# Altium schematic sheet Program Counter.SchDoc
size B; Author: E. Sims; Organization: Let's Build Rockets Inc.; SheetNumber: 4; SheetTotal: 11
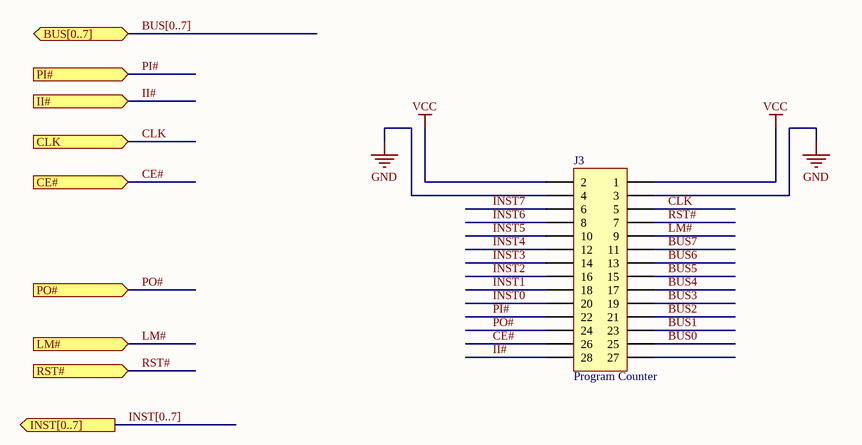
[diagram p0: Program Counter.SchDoc]

## Parts
J3  Program Counter  [HDR2X14]

## Ports
BUS[0..7] (bidir), CE# (in), CLK (in), II# (in), INST[0..7] (out), LM# (in), PI# (in), PO# (in), RST# (in)

## Nets
GND: J3.3 J3.4
VCC: J3.1 J3.2
BUS0: J3.25
BUS1: J3.23
BUS2: J3.21
BUS3: J3.19
BUS4: J3.17
BUS5: J3.15
BUS6: J3.13
BUS7: J3.11
CE#: J3.26 ; port CE#
CLK: J3.5 ; port CLK
II#: J3.28 ; port II#
INST0: J3.20
INST1: J3.18
INST2: J3.16
INST3: J3.14
INST4: J3.12
INST5: J3.10
INST6: J3.8
INST7: J3.6
LM#: J3.9 ; port LM#
PI#: J3.22 ; port PI#
PO#: J3.24 ; port PO#
RST#: J3.7 ; port RST#

Not connected (* = marked no-connect by the designer): J3 27

## Buses and harness runs
bus BUS[0..7] = port BUS[0..7]
bus INST[0..7] = port INST[0..7]

## Notes on the sheet
- Let's Build Rocket's Inc. Modular Paylaod System Based on TMP-010 Rev
  For more information visit https://github.com/LetsBuildRockets/Modular-Payload-System
  This work is licensed under CC BY-NC 4.0. To view a copy of this license, visit https://creativecommons.org/licenses/by-nc/4.0
- Title
- Size:
- Date:
- Assembly Variant:
- B
- Number:
- Time:
- Revision:
- Sheet
- of
- Author:
- File:

## Library data of the parts
J3 = Header 14X2: Header, 14-Pin, Dual row; System: Connector; LatestRevisionDate: 17-Jul-2002; LatestRevisionNote: Re-released for DXP Platform.; Publisher: Altium Limited